# Altium schematic sheet PG4 SHEET2.schdoc
size B; Date: 2/10/2009; ApprovedBy: Touraj; DrawnBy: Juan A. Nadal; Engineer: Touraj; Organization: ActiveWave; Address1: 902 Clint Moore Rd., Suite 118; Address2: Boca Raton; Address3: FL, 33487; Address4: 561-999-9422; DocumentNumber: 4; Revision: 20; SheetNumber: 4; SheetTotal: 4; PageSetup: Record=PageOptions|CenterHorizontal=True|CenterVertical=True|PrintScale=0.70|XCorrection=1.00|YCorrection=1.00|PrintKind=0|BorderSize=5000000|LeftOffset=0|BottomOffset=0|Orientation=2|PaperLength=1000|PaperWidth=1000|Scale=100|PaperSource=7|PrintQuality=-4|MediaType=1|DitherType=10|PaperKind=Letter|PrintScaleMode=1; Project: Tag105
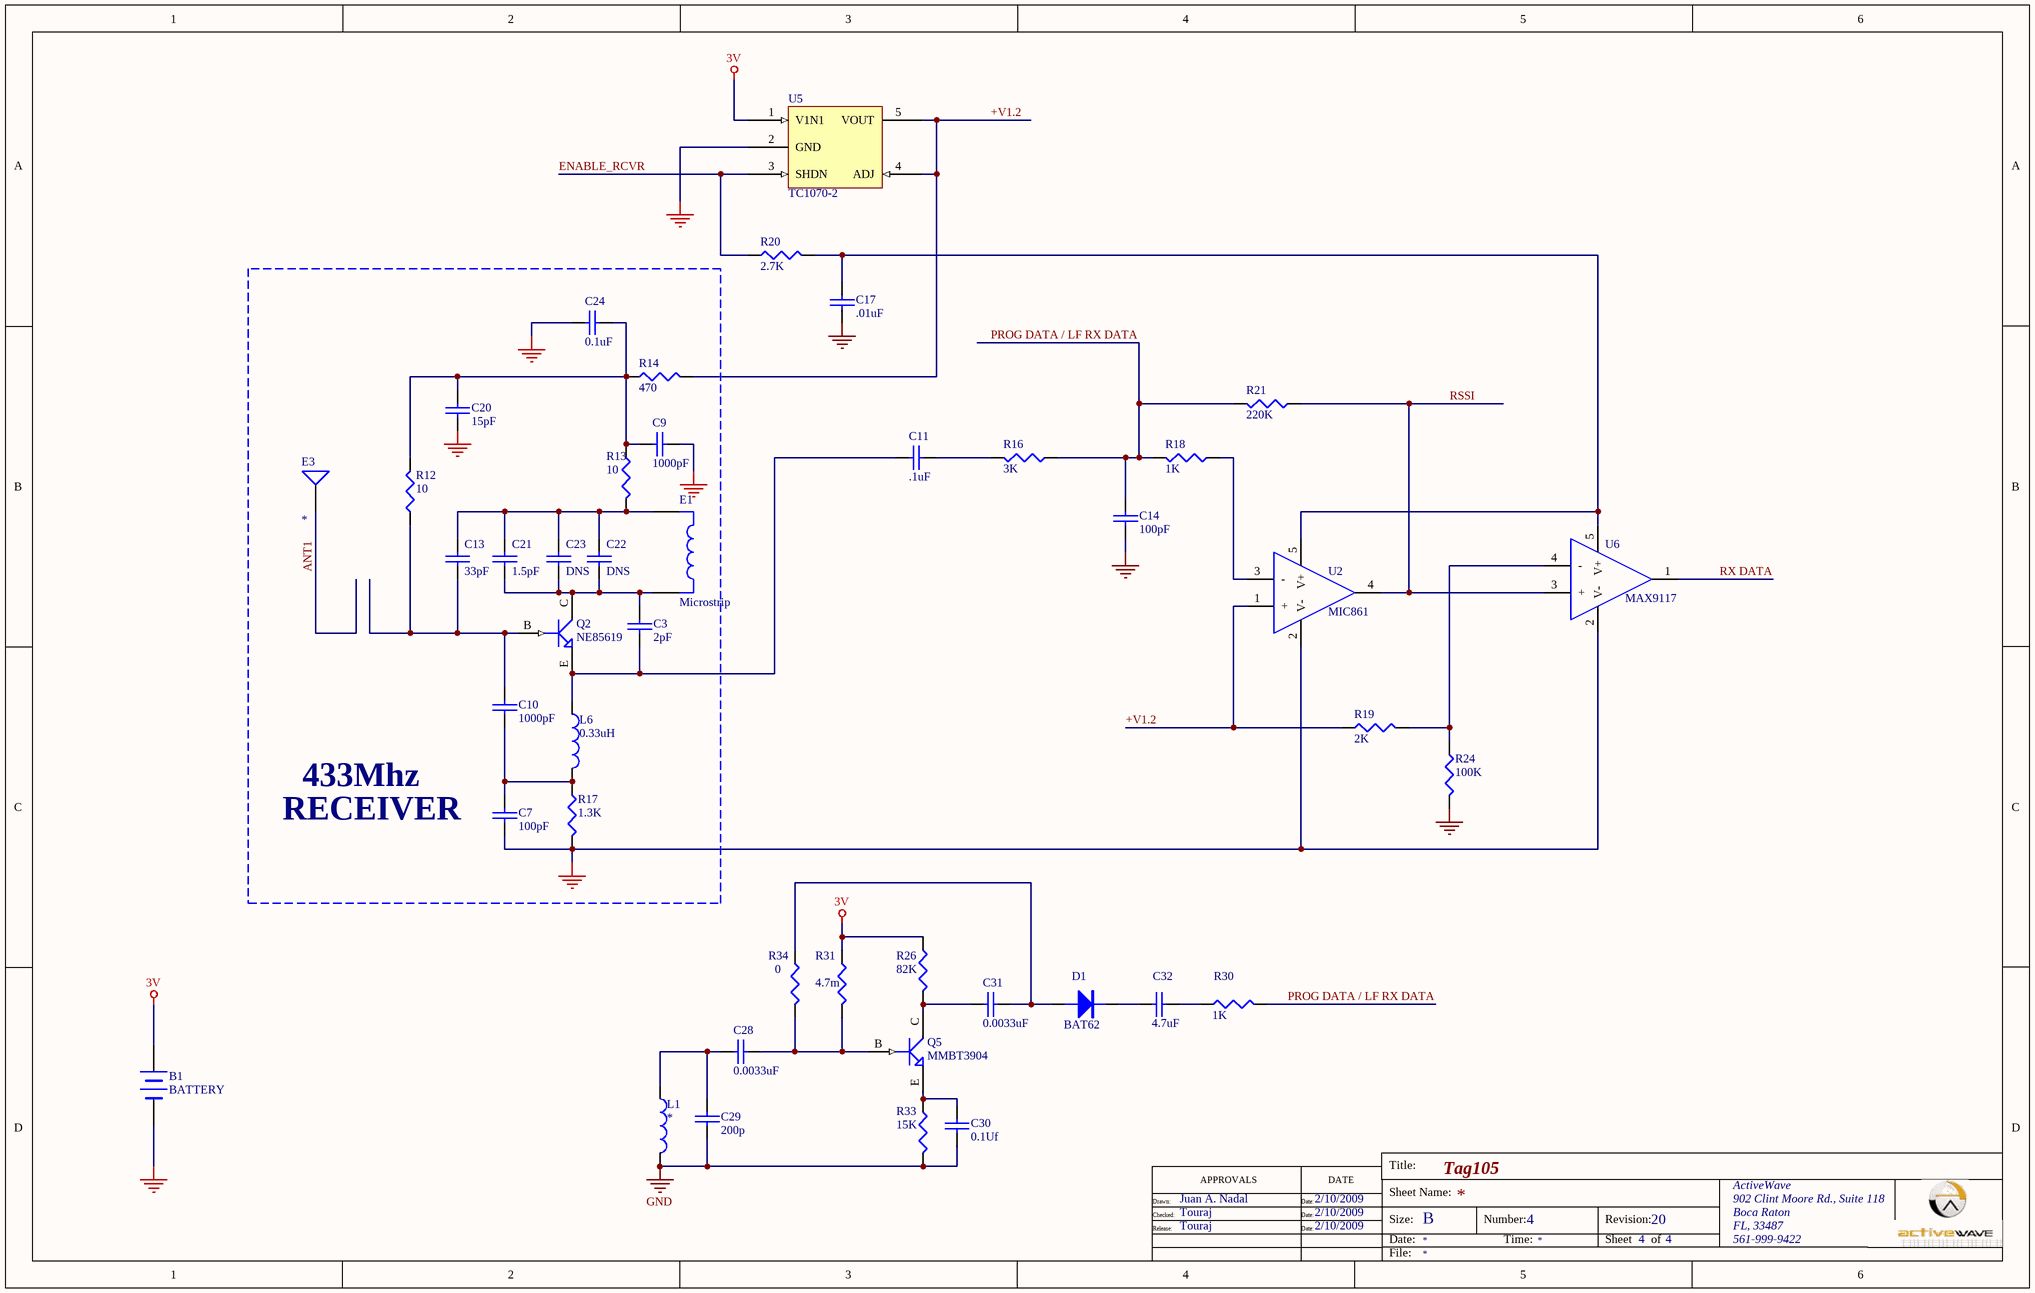
[diagram p0: PG4 SHEET2.schdoc]

## Parts
B1  BATTERY  [BATT HOLDER COIN CR2032 CUT]
C3  2pF  [0603]
C7  100pF  [0603]
C9  1000pF  [0603]
C10  1000pF  [0603]
C11  .1uF  [0603]
C13  33pF  [0603]
C14  100pF  [0603]
C17  .01uF  [0603]
C20  15pF  [0603]
C21  1.5pF  [0603]
C22  DNS  [0603]
C23  DNS  [0603]
C24  0.1uF  [0603]
C28  0.0033uF  [0603]
C29  200p  [0603]
C30  0.1Uf  [0603]
C31  0.0033uF  [0603]
C32  4.7uF  [0603]
D1  BAT62  [SMCR_SOD323_V1]
E1  Microstrip  [Antenna]  (net tie, no BOM)
E3  *  [Antenna1]
L1  *  [4308RV]
L6  0.33uH  [0603]
Q2  NE85619  [3 PIN ULTRA SUPER MINI MOLD]
Q5  MMBT3904  [SOT23-EBC]
R12  10  [0603]
R13  10  [0603]
R14  470  [0603]
R16  3K  [0603]
R17  1.3K  [0603]
R18  1K  [0603]
R19  2K  [0603]
R20  2.7K  [0603]
R21  220K  [0603]
R24  100K  [0603]
R26  82K  [0603]
R30  1K  [0603]
R31  4.7m  [0603]
R33  15K  [0603]
R34  0  [0603]
U2  MIC861  [SC70]
U5  TC1070-2  [SOT23-5A]
U6  MAX9117  [SC70]

## Nets
3V: B1.2(+) R26.1 R31.1 U5.1(V1N1)
GND: B1.1(-) C7.2 C9.2 C14.1 C17.2 C20.2 C24.2 C29.1 C30.1 L1.2 R17.2 R24.2 R33.2 U2.2(V-) U5.2(GND) U6.2(V-)
+V1.2: R14.2 R19.1 U2.1(+) U5.4(ADJ) U5.5(VOUT)
ANT1: E3.1
ENABLE_RCVR: R20.1 U5.3(SHDN)
PROG DATA / LF RX DATA: C14.2 R16.1 R18.2 R21.2 R30.2
RSSI: R21.1 U2.4(OUT) U6.3(+)
RX DATA: U6.1(OUT)
NetC3_1: C3.1 C21.2 C22.2 C23.2 E1.1 Q2.C
NetC3_2: C3.2 C11.1 L6.1 Q2.E
NetC7_1: C7.1 C10.2 L6.2 R17.1
NetC9_1: C9.1 C20.1 C24.1 R12.2 R13.1 R14.1
NetC10_1: C10.1 C13.2 Q2.B R12.1
NetC11_2: C11.2 R16.2
NetC13_1: C13.1 C21.1 C22.1 C23.1 E1.2 R13.2
NetC17_1: C17.1 R20.2 U2.5(V+) U6.5(V+)
NetC28_1: C28.1 C29.2 L1.1
NetC28_2: C28.2 Q5.B R31.2 R34.2
NetC30_2: C30.2 Q5.E R33.1
NetC31_1: C31.1 Q5.C R26.2
NetC31_2: C31.2 D1.A R34.1
NetC32_1: C32.1 D1.K
NetC32_2: C32.2 R30.1
NetR18_1: R18.1 U2.3(-)
NetR19_2: R19.2 R24.1 U6.4(-)

## Notes on the sheet
- RECEIVER
- 433Mhz
- APPROVALS
- DATE
- Title:
- Drawn:
- Checked:
- Release:
- Date:
- Size:
- Sheet Name:
- B
- Number:
- Time:
- Revision:
- Sheet
- of
- File:

## Library data of the parts
C3 C7 C9-C11 C13 C14 C17 C20-C24 C28-C32 = CAP-0603: Capacitor; ACTIVEWAVE-P/N: *; ITEM-DESCRIPTION: *; MANUFACTURER: *; MFGR-P/N: *
  C3: VALUE: 2pF
  C7 C14: VALUE: 100pF
  C9 C10: VALUE: 1000pF
  C11: VALUE: .1uF
  C13: VALUE: 33pF
  C17: VALUE: .01uF
  C20: VALUE: 15pF
  C21: VALUE: 1.5pF
  C22 C23: VALUE: DNS
  C24: VALUE: 0.1uF
  C28 C31: VALUE: 0.0033uF
  C29: VALUE: 200p
  C30: VALUE: 0.1Uf
  C32: VALUE: 4.7uF
D1 = DIODE: ACTIVEWAVE-P/N: *; ITEM-DESCRIPTION: *; MANUFACTURER: *; MFGR-P/N: *; VALUE: BAT62
E1 = ANTENNA: PART-VALUE: *; ITEM-DESCRIPTION: Microstrip
E3 = Antenna1: VALUE: *
L1 = INDUCTOR_V1: ACTIVEWAVE-P/N: *; ITEM-DESCRIPTION: *; MANUFACTURER: *; MFGR-P/N: *; VALUE: *
L6 = INDUCTOR: ACTIVEWAVE-P/N: *; ITEM-DESCRIPTION: *; MANUFACTURER: *; MFGR-P/N: *; VALUE: 0.33uH
Q2 = NE85619: TRANSISTOR NPN 1GHZ SMD; MANUFACTURER: ??????; ACTIVEWAVE-P/N: *; ITEM-DESCRIPTION: TRANSISTOR NPN 1GHZ SMD; MFGR-P/N: ??????; VALUE: NE85619
Q5 = MMBT3904: NPN SWITCHING TRANSTOR; MANUFACTURER: ??????; ITEM-DESCRIPTION: TRANSISTOR NPN 1GHZ SMD; ACTIVEWAVE-P/N: *; MFGR-P/N: ??????; VALUE: MMBT3904
R12-R14 R16-R21 R24 R26 R30 R31 R33 R34 = RES-0603: ACTIVEWAVE-P/N: *; MFGR-P/N: *; MANUFACTURER: *; ITEM-DESCRIPTION: *
  R12 R13: VALUE: 10
  R14: VALUE: 470
  R16: VALUE: 3K
  R17: VALUE: 1.3K
  R18 R30: VALUE: 1K
  R19: VALUE: 2K
  R20: VALUE: 2.7K
  R21: VALUE: 220K
  R24: VALUE: 100K
  R26: VALUE: 82K
  R31: VALUE: 4.7m
  R33: VALUE: 15K
  R34: VALUE: 0
U2 = MIC861BC5: Ultra Low Power Op Amp; MANUFACTURER: MICREL; ACTIVEWAVE-P/N: *; ITEM-DESCRIPTION: Ultra Low Power Op Amp; MFGR-P/N: MIC861BC5; VALUE: MIC861
U5 = TC1070-2: Adjustable CMOS LDOs with Shutdown; MANUFACTURER: Microchip Technology; ITEM-DESCRIPTION: 50mA, 100mA and 150mA Adjustable CMOS LDOs with Shutdown; MFGR-P/N: TC1070; ACTIVEWAVE-P/N: *; VALUE: TC1070-2
U6 = COMPARATOR MAX9117: MAX9117 Comparators; MANUFACTURER: MAXIM; ITEM-DESCRIPTION: SC70, 1.6V, Nanopower, Beyond-the-Rails Comparators With/Without Reference; MFGR-P/N: ??????; ACTIVEWAVE-P/N: *; VALUE: MAX9117
B1 = BATTERY: ACTIVEWAVE-P/N: *; ITEM-DESCRIPTION: *; MANUFACTURER: *; MFGR-P/N: *; VALUE: BATTERY